# Altium schematic sheet Connector-USB.SchDoc: =ProjectTitle
size 297 x 209 mm; Address1: Address1; Address2: Address2; Address3: Address3; Address4: Address4; SheetNumber: 14; SheetTotal: 16; Scale: 1:1; DocumentType: Схема электрическая принципиальная
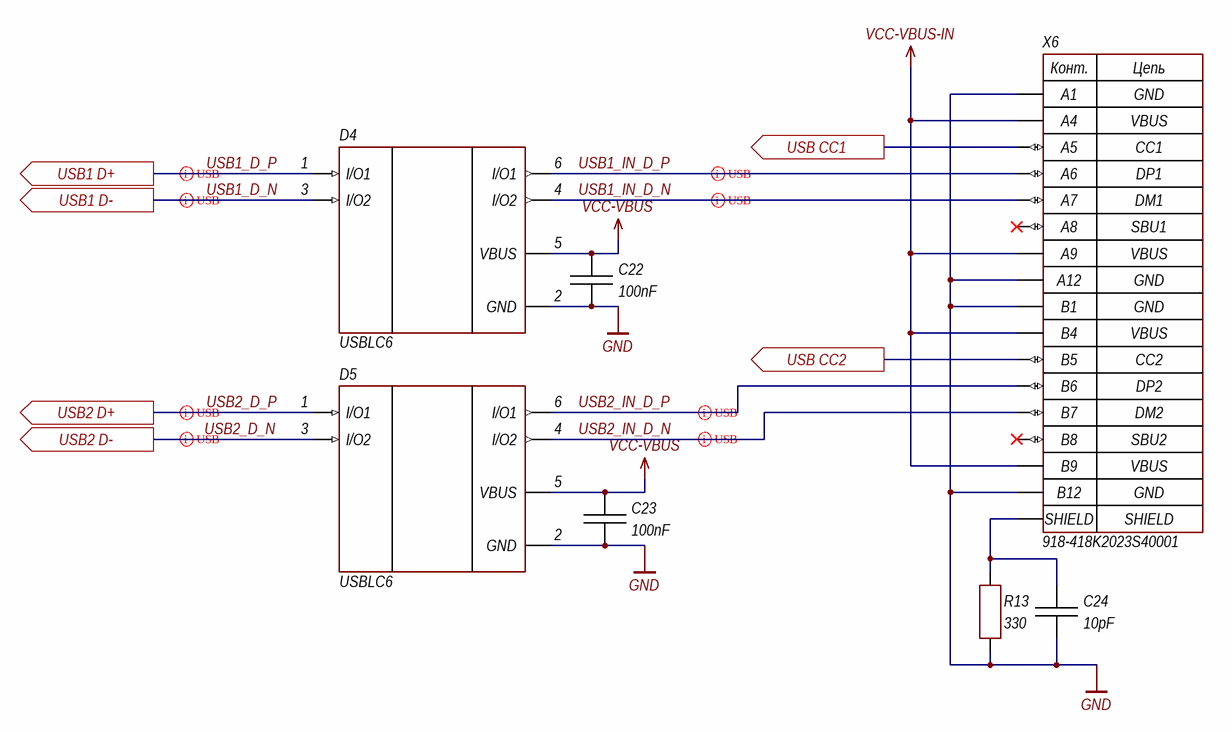
[diagram p0: Connector-USB.SchDoc]

## Parts
C22  100nF  [CH0402C]
C23  100nF  [CH0402C]
C24  10pF  [CH0402C]
D4  USBLC6  [SOT666]
D5  USBLC6  [SOT666]
R13  330  [CH0402R]
X6  918-418K2023S40001  [CON:  918-418K2023S40001]

## Ports
USB1 D+ (out), USB1 D- (out), USB2 D+ (out), USB2 D- (out), USB CC1 (out), USB CC2 (out)

## Nets
GND: C22.1 C23.1 C24.1 D4.2(GND) D5.2(GND) R13.1 X6.A1 X6.A12 X6.B1 X6.B12
VCC-VBUS: C22.2 C23.2 D4.5(VBUS) D5.5(VBUS)
VCC-VBUS-IN: X6.A4 X6.A9 X6.B4 X6.B9
USB1_D_N: D4.3(I/O2) ; port USB1 D-
USB1_D_P: D4.1(I/O1) ; port USB1 D+
USB1_IN_D_N: D4.4(I/O2) X6.A7
USB1_IN_D_P: D4.6(I/O1) X6.A6
USB2_D_N: D5.3(I/O2) ; port USB2 D-
USB2_D_P: D5.1(I/O1) ; port USB2 D+
USB2_IN_D_N: D5.4(I/O2) X6.B7
USB2_IN_D_P: D5.6(I/O1) X6.B6
USB CC1: X6.A5 ; port USB CC1
USB CC2: X6.B5 ; port USB CC2
NetC24_2: C24.2 R13.2 X6.SHIELD

Not connected (* = marked no-connect by the designer): X6 A8* B8*

## Layout directives
differential pair; differential pair class D90; rule Matched Net Lengths [Tolerance = 0.5mm]: USB1_D_N, USB1_D_P, USB1_IN_D_N, USB1_IN_D_P, USB2_D_N, USB2_D_P, USB2_IN_D_N, USB2_IN_D_P

## Notes on the sheet
- Изм.
- Лист
- № докум.
- Подп.
- Дата
- Копировал
- Формат А4
- (in symbol USB-C-12(16)) Конт.; Цепь; GND; VBUS; CC1; DP1; DM1; SBU1; CC2; DP2; DM2; SBU2

## Library data of the parts
C22-C24 = Capacitor: Manufacturer: *; Model: *; HelpURL: *; ComponentKind: *
  C22 C23: Value: 100nF
  C24: Value: 10pF
D4 D5 = USBLC6: USB protection; Manufacturer: STMicroelectronics; Model: USBLC6; ComponentKind: SOT23-6, SOT-666; HelpURL: https://www.digikey.com/product-detail/en/stmicroelectronics/USBLC6-2SC6Y/497-11882-1-ND/2756523
R13 = Resistor: Manufacturer: *; Model: *; HelpURL: *; ComponentKind: *; Value: 330
X6 = USB-C-12(16): USB-C 2.0 12(16)-pin; Model: 918-418K2023S40001; Manufacturer: *; HelpURL: *; ComponentKind: *